# EAGLE design Motherboard (EAGLE 9.6.2)
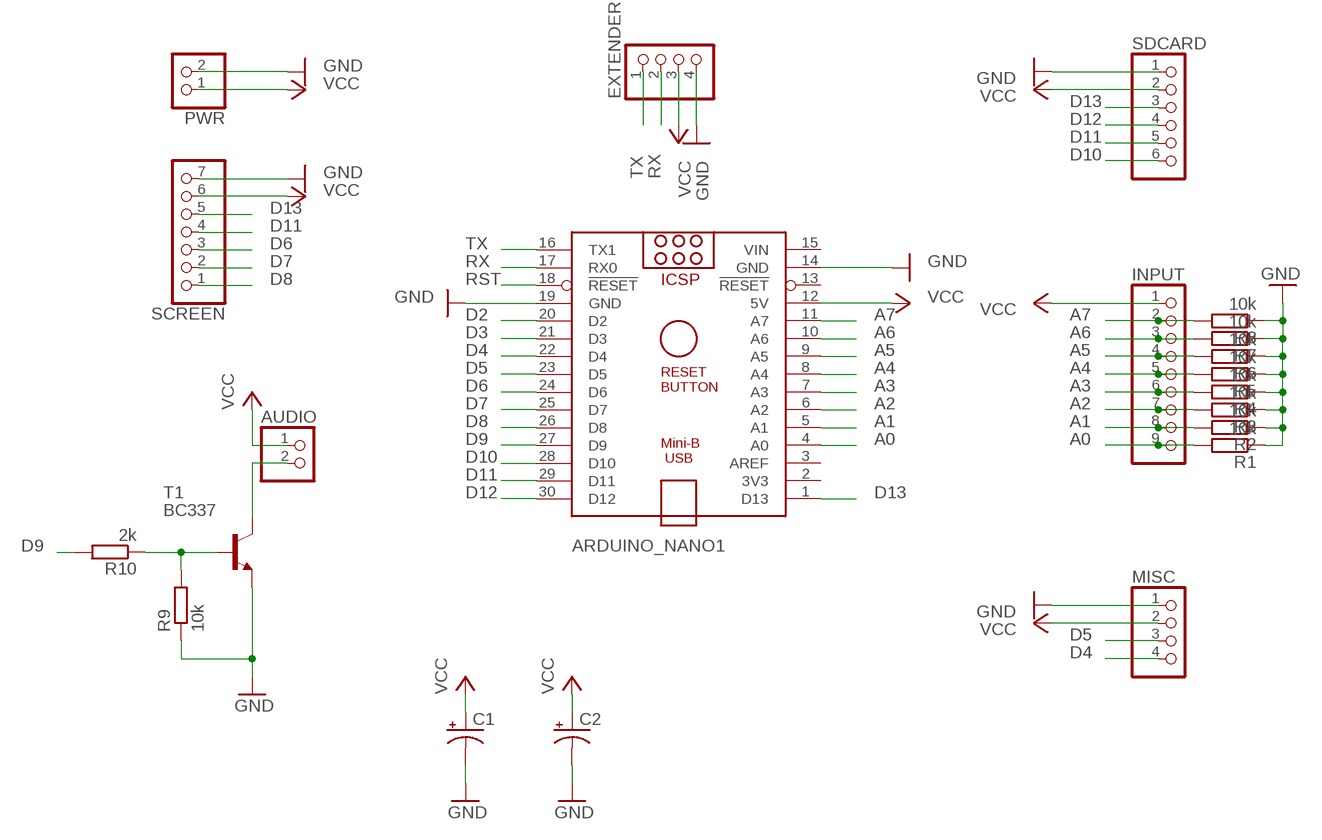
[diagram p0: schematic, sheet 1]

## Parts
ARDUINO_NANO1  ARDUINO_NANO  [ARDUINO_NANO]
AUDIO  PINHD-1X2  [1X02]
C1  CPOL-USE2.5-6  [E2,5-6]
C2  CPOL-USE2.5-6  [E2,5-6]
EXTENDER  PINHD-1X4  [1X04]
INPUT  PINHD-1X9  [1X09]
MISC  PINHD-1X4  [1X04]
PWR  PINHD-1X2  [1X02]
R1  10k  R-EU_0204/7  [0204/7]
R2  10k  R-EU_0204/7  [0204/7]
R3  10k  R-EU_0204/7  [0204/7]
R4  10k  R-EU_0204/7  [0204/7]
R5  10k  R-EU_0204/7  [0204/7]
R6  10k  R-EU_0204/7  [0204/7]
R7  10k  R-EU_0204/7  [0204/7]
R8  10k  R-EU_0204/7  [0204/7]
R9  10k  R-EU_0204/7  [0204/7]
R10  2k  R-EU_0204/7  [0204/7]
SCREEN  PINHD-1X7  [1X07]
SDCARD  PINHD-1X6  [1X06]
T1  BC337  [TO92]

## Nets
A0: ARDUINO_NANO1.4(A0) INPUT.9 R1.2
A1: ARDUINO_NANO1.5(A1) INPUT.8 R2.2
A2: ARDUINO_NANO1.6(A2) INPUT.7 R3.2
A3: ARDUINO_NANO1.7(A3) INPUT.6 R4.2
A4: ARDUINO_NANO1.8(A4) INPUT.5 R5.2
A5: ARDUINO_NANO1.9(A5) INPUT.4 R6.2
A6: ARDUINO_NANO1.10(A6) INPUT.3 R7.2
A7: ARDUINO_NANO1.11(A7) INPUT.2 R8.2
D2: ARDUINO_NANO1.20(D2)
D3: ARDUINO_NANO1.21(D3)
D4: ARDUINO_NANO1.22(D4) MISC.4
D5: ARDUINO_NANO1.23(D5) MISC.3
D6: ARDUINO_NANO1.24(D6) SCREEN.3
D7: ARDUINO_NANO1.25(D7) SCREEN.2
D8: ARDUINO_NANO1.26(D8) SCREEN.1
D9: ARDUINO_NANO1.27(D9) R10.2
D10: ARDUINO_NANO1.28(D10) SDCARD.6
D11: ARDUINO_NANO1.29(D11) SCREEN.4 SDCARD.5
D12: ARDUINO_NANO1.30(D12) SDCARD.4
D13: ARDUINO_NANO1.1(D13) SCREEN.5 SDCARD.3
GND: ARDUINO_NANO1.14(GND) ARDUINO_NANO1.19(GND) C1.- C2.- EXTENDER.4 MISC.1 PWR.2 R1.1 R2.1 R3.1 R4.1 R5.1 R6.1 R7.1 R8.1 R9.1 SCREEN.7 SDCARD.1 T1.1(E)
N$12: AUDIO.2 T1.3(C)
N$13: R9.2 R10.1 T1.2(B)
RST: ARDUINO_NANO1.18(!RESET)
RX: ARDUINO_NANO1.17(RX0) EXTENDER.2
TX: ARDUINO_NANO1.16(TX1) EXTENDER.1
VCC: ARDUINO_NANO1.12(5V) AUDIO.1 C1.+ C2.+ EXTENDER.3 INPUT.1 MISC.2 PWR.1 SCREEN.6 SDCARD.2
Unconnected: ARDUINO_NANO1.2(3V3) ARDUINO_NANO1.3(AREF) ARDUINO_NANO1.13(!RESET)

## Power pins joined to a net without a drawn wire
VIN: ARDUINO_NANO1.15(VIN)

## Library data of the parts
ARDUINO_NANO1 = ArduinoNanoV30:ARDUINO_NANO: Arduino Nano V3.0 Overview: The Arduino Nano is a small, complete, and breadboard-friendly board based on the ATmega328 (Arduino Nano 3.x) or ATmega168 (Arduino Nano 2.x). It has more or less the same functionality of the Arduino Duemilanove, but in a different package. It lacks only a DC power jack, and works with a Mini-B USB cable instead of a standard one. The Nano was designed and is being produced by Gravitech. Specifications: Microcontroller Atmel ATmega168 or ATmega328 Operating Voltage (logic level) 5 V Input Voltage (recommended) 7-12 V Input Voltage (limits) 6-20 V Digital I/O Pins 14 (of which 6 provide PWM output) Analog Input Pins 8 DC Current per I/O Pin 40 mA Flash Memory 16 KB (ATmega168) or 32 KB (ATmega328) of which 2 KB used by bootloader SRAM 1 KB (ATmega168) or 2 KB (ATmega328) EEPROM 512 bytes (ATmega168) or 1 KB (ATmega328) Clock Speed 16 MHz Dimensions 0.73" x 1.70" Length 45 mm Width 18 mm Weigth 5 g Power: The Arduino Nano can be powered via the Mini-B USB connection, 6-20V unregulated external power supply (pin 30), or 5V regulated external power supply (pin 27). The power source is automatically selected to the highest voltage source. Memory: The ATmega168 has 16 KB of flash memory for storing code (of which 2 KB is used for the bootloader); the ATmega328 has 32 KB, (also with 2 KB used for the bootloader). The ATmega168 has 1 KB of SRAM and 512 bytes of EEPROM (which can be read and written with the EEPROM library); the ATmega328 has 2 KB of SRAM and 1 KB of EEPROM. Input and Output: Each of the 14 digital pins on the Nano can be used as an input or output, using pinMode(), digitalWrite(), and digitalRead() functions. They operate at 5 volts. Each pin can provide or receive a maximum of 40 mA and has an internal pull-up resistor (disconnected by default) of 20-50 kOhms. In addition, some pins have specialized functions. Visit Arduino - ArduinoBoardNano <https://www.arduino.cc/en/Main/ArduinoBoardNano>
AUDIO PWR = pinhead:PINHD-1X2: PIN HEADER
C1 C2 = rcl:CPOL-US: POLARIZED CAPACITOR, American symbol; SPICEPREFIX: C
EXTENDER MISC = pinhead:PINHD-1X4: PIN HEADER
INPUT = pinhead:PINHD-1X9: PIN HEADER
R1-R10 = rcl:R-EU_: RESISTOR, European symbol; SPICEPREFIX: R
SCREEN = pinhead:PINHD-1X7: PIN HEADER
SDCARD = pinhead:PINHD-1X6: PIN HEADER
T1 = transistor:BC337: NPN TRANSISTOR

## Board
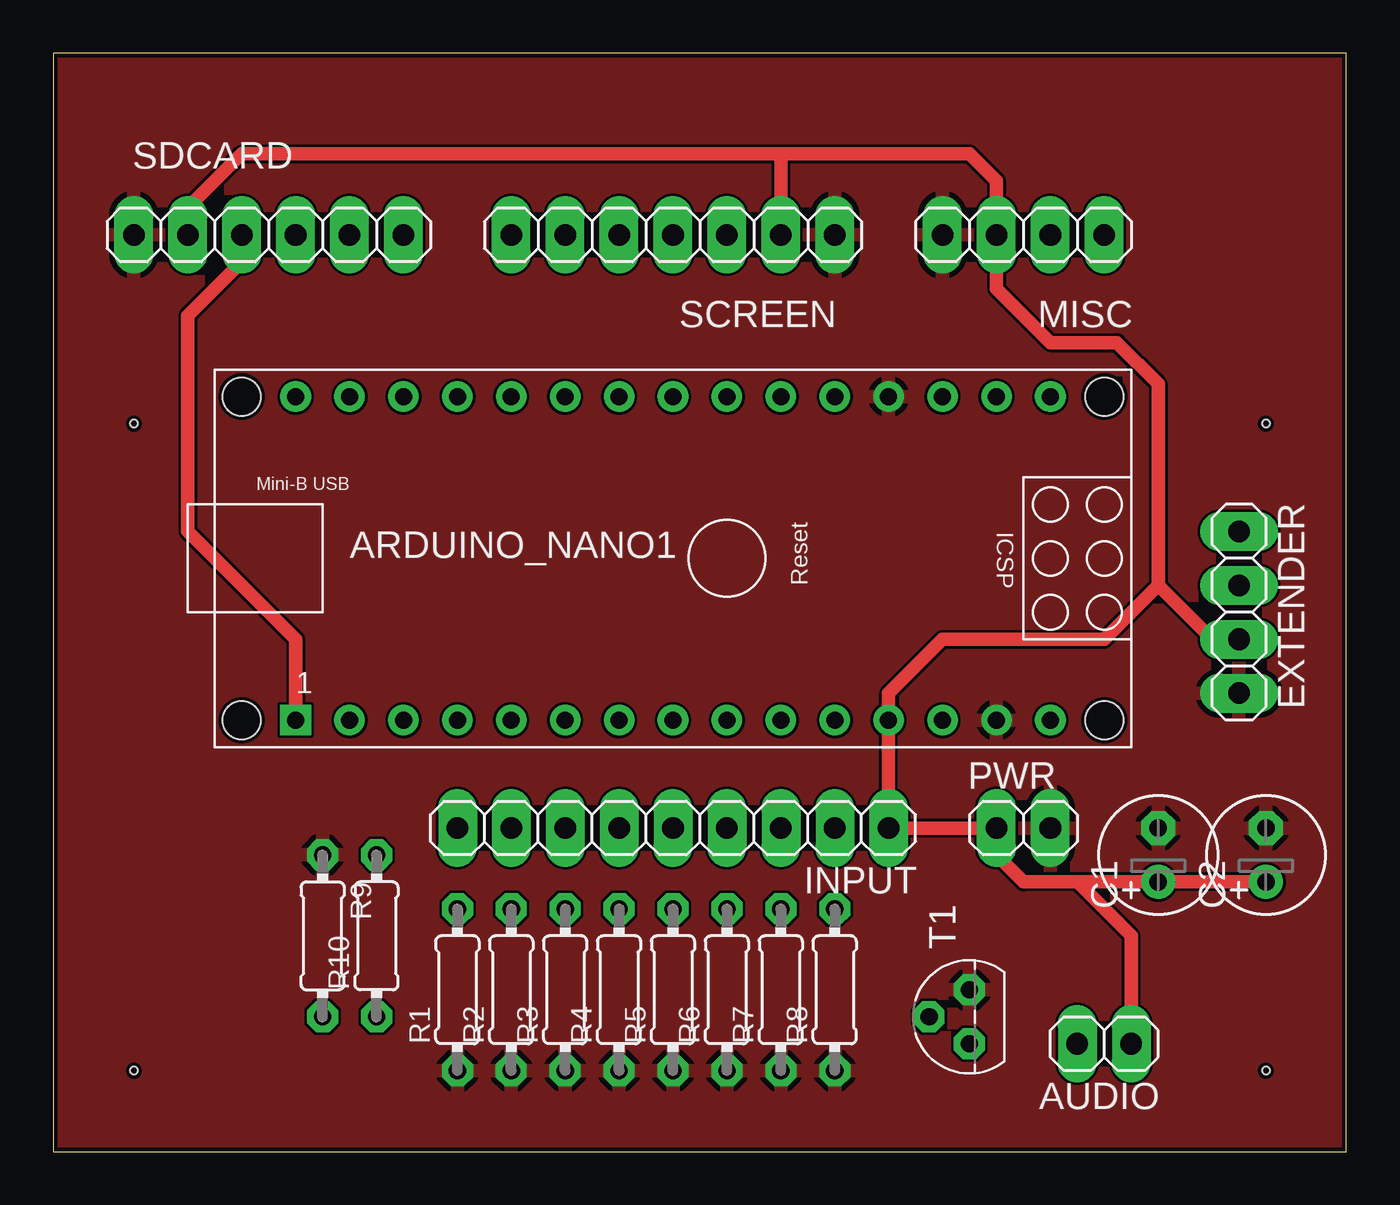
[diagram p1: board, top side]
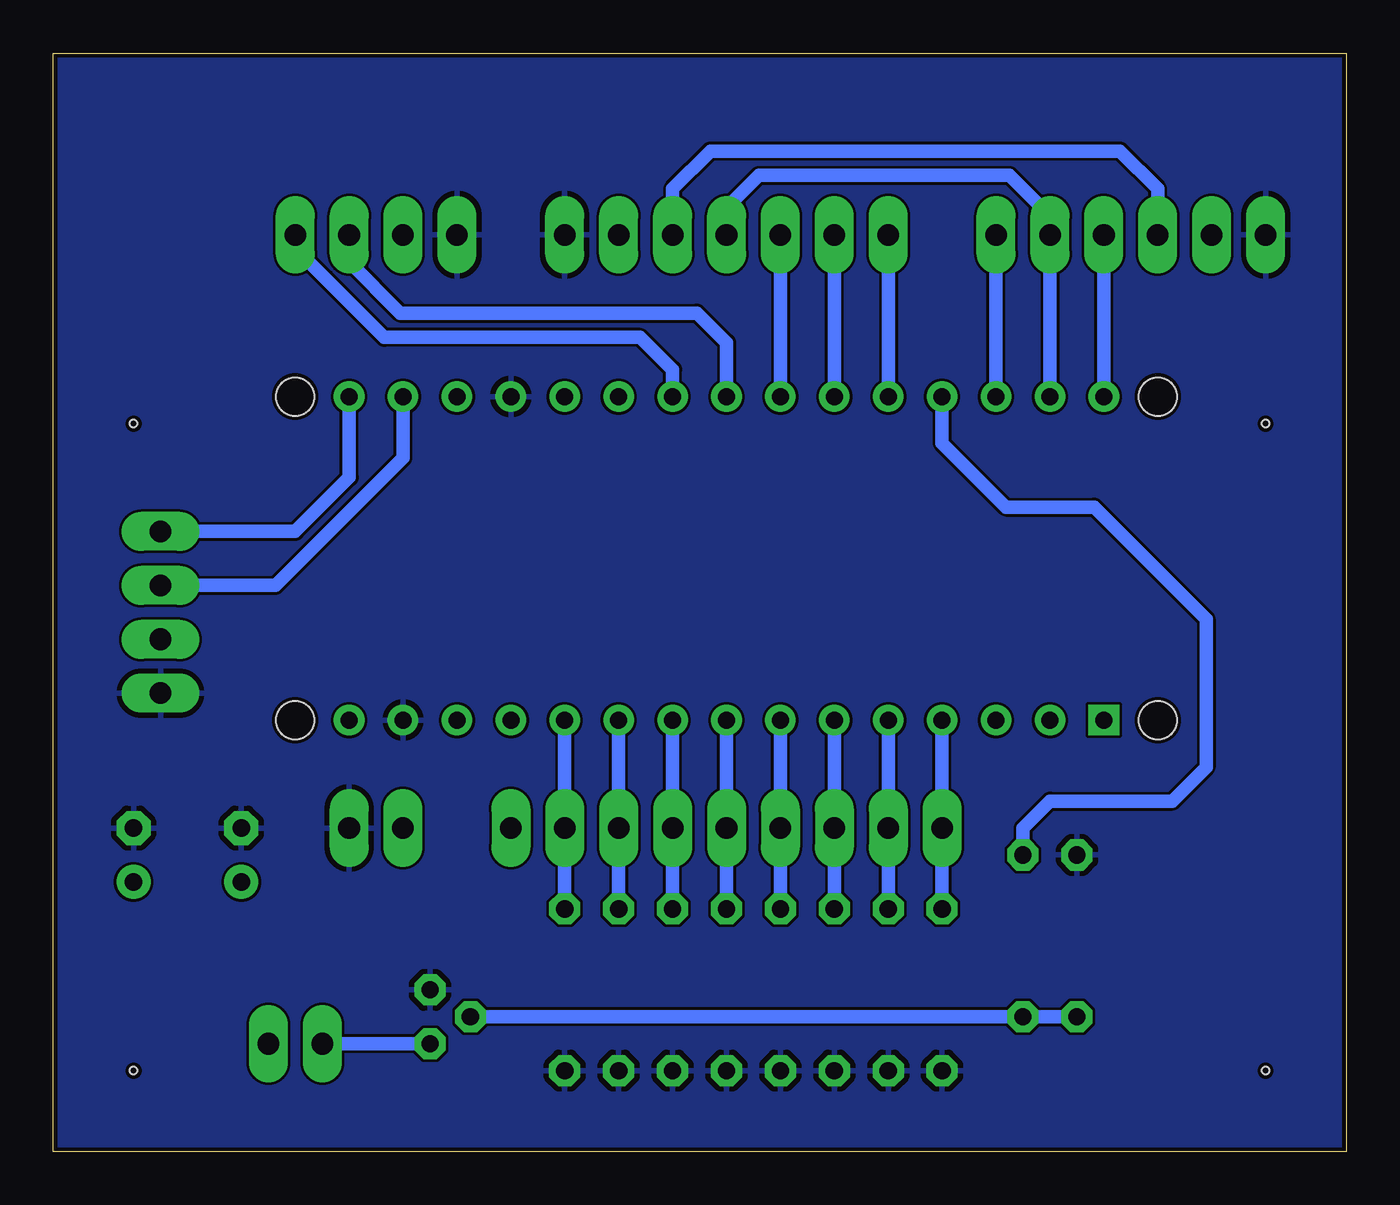
[diagram p2: board, bottom side, seen from below]

Size 60.94 x 51.74 mm. Coordinates in mm from the lower left corner, seen from the top.
Outline: 0,0 60.94,0 60.94,51.74 0,51.74 0,0
Copper layers (1*16): Top 0.035mm / dielectric 1.6mm / Bottom 0.035mm
Design rules "jlcpcb-2layers": minimum track width 5mil, minimum drill 0.3mm, track to track 5mil, track to pad 5mil, pad to pad 5mil, via to via 5mil, smd to smd 5mil, copper to edge 0.2mm, drill to drill 6mil, minimum pad ring 10mil, minimum via ring 3mil, stop-mask expansion 4mil, vias tented up to drill 0mil, thermal gap 10mil
Holes 0.35 mm at 57.15,3.81 3.81,3.81 3.81,34.29 57.15,34.29

### Footprints (pad centres in the part's own frame; a part is rotated, then mirrored left to right if it is on the bottom)
ARDUINO_NANO = drill 0.8 square: 1 -20.32,-7.62 | drill 0.8: 2 -17.78,-7.62; 3 -15.24,-7.62; 4 -12.7,-7.62; 5 -10.16,-7.62; 6 -7.62,-7.62; 7 -5.08,-7.62; 8 -2.54,-7.62; 9 0,-7.62; 10 2.54,-7.62; 11 5.08,-7.62; 12 7.62,-7.62; 13 10.16,-7.62; 14 12.7,-7.62; 15 15.24,-7.62; 16 15.24,7.62; 17 12.7,7.62; 18 10.16,7.62; 19 7.62,7.62; 20 5.08,7.62; 21 2.54,7.62; 22 0,7.62; 23 -2.54,7.62; 24 -5.08,7.62; 25 -7.62,7.62; 26 -10.16,7.62; 27 -12.7,7.62; 28 -15.24,7.62; 29 -17.78,7.62; 30 -20.32,7.62 | hole 1.778: -22.86,-7.62; -22.86,7.62; 17.78,7.62; 17.78,-7.62
1X02 = drill 1.016 long: 1 -1.27,0; 2 1.27,0
E2,5-6 = drill 0.813 pad 1.6: + -1.27,0 | drill 0.813 pad 1.6 octagon: - 1.27,0
1X04 = drill 1.016 long: 1 -3.81,0; 2 -1.27,0; 3 1.27,0; 4 3.81,0
1X09 = drill 1.016 long: 1 -10.16,0; 2 -7.62,0; 3 -5.08,0; 4 -2.54,0; 5 0,0; 6 2.54,0; 7 5.08,0; 8 7.62,0; 9 10.16,0
0204/7 = drill 0.813 octagon: 1 -3.81,0; 2 3.81,0
1X07 = drill 1.016 long: 1 -7.62,0; 2 -5.08,0; 3 -2.54,0; 4 0,0; 5 2.54,0; 6 5.08,0; 7 7.62,0
1X06 = drill 1.016 long: 1 -6.35,0; 2 -3.81,0; 3 -1.27,0; 4 1.27,0; 5 3.81,0; 6 6.35,0
TO92 = drill 0.813 octagon: 1 1.27,0; 2 0,1.905; 3 -1.27,0

### Placement (x,y rotation side)
ARDUINO_NANO1  31.75,27.94 0 top
AUDIO  49.53,5.08 180 top
C1  52.07,13.97 90 top
C2  57.15,13.97 90 top
EXTENDER  55.88,25.4 270 top
INPUT  29.21,15.24 180 top
MISC  45.72,43.18 0 top
PWR  45.72,15.24 0 top
R1  19.05,7.62 90 top
R2  21.59,7.62 90 top
R3  24.13,7.62 90 top
R4  26.67,7.62 90 top
R5  29.21,7.62 90 top
R6  31.75,7.62 90 top
R7  34.29,7.62 90 top
R8  36.83,7.62 90 top
R9  12.7,10.16 270 top
R10  15.24,10.16 90 top
SCREEN  29.21,43.18 0 top
SDCARD  10.16,43.18 0 top
T1  43.18,6.35 90 top

### Tracks (layer width: path | path; a pad name or v marks a point on that pad's centre or on a via)
A0
  Bottom 0.635: R1.2 INPUT.9 ARDUINO_NANO1.4
A1
  Bottom 0.635: R2.2 INPUT.8 ARDUINO_NANO1.5
A2
  Bottom 0.635: R3.2 INPUT.7 ARDUINO_NANO1.6
A3
  Bottom 0.635: R4.2 INPUT.6 ARDUINO_NANO1.7
A4
  Bottom 0.635: R5.2 INPUT.5 ARDUINO_NANO1.8
A5
  Bottom 0.635: R6.2 INPUT.4 ARDUINO_NANO1.9
A6
  Bottom 0.635: ARDUINO_NANO1.10 INPUT.3 R7.2
A7
  Bottom 0.635: ARDUINO_NANO1.11 INPUT.2 R8.2
D4
  Bottom 0.635: ARDUINO_NANO1.22 31.75,36.83 33.27,38.35 45.34,38.35 49.53,42.55 MISC.4
D5
  Bottom 0.635: MISC.3 46.99,41.91 44.58,39.5 30.61,39.5 29.21,38.1 ARDUINO_NANO1.23
D6
  Bottom 0.635: SCREEN.3 ARDUINO_NANO1.24
D7
  Bottom 0.635: ARDUINO_NANO1.25 SCREEN.2
D8
  Bottom 0.635: SCREEN.1 ARDUINO_NANO1.26
D9
  Bottom 0.635: ARDUINO_NANO1.27 19.05,33.37 16.04,30.35 11.88,30.35 6.6,25.08 6.6,18.1 8.2,16.51 13.97,16.51 15.24,15.24 R10.2
D10
  Bottom 0.635: ARDUINO_NANO1.28 SDCARD.6
D11
  Bottom 0.635: ARDUINO_NANO1.29 SDCARD.5 13.97,44.07 15.88,45.97 27.69,45.97 29.21,44.45 SCREEN.4
D12
  Bottom 0.635: ARDUINO_NANO1.30 SDCARD.4
D13
  Top 0.635: SDCARD.3 8.89,41.91 6.35,39.37 6.35,29.21 11.43,24.13 ARDUINO_NANO1.1
  Bottom 0.635: SDCARD.3 8.89,45.34 10.67,47.12 29.97,47.12 31.75,45.34 SCREEN.5
GND
  pour Bottom: -1.27,80.01 76.2,80.01 76.2,-1.27 -1.27,-1.27
  pour Top: 0,52.07 60.96,52.07 62.23,53.34 62.23,0 0,0
N$12
  Bottom 0.635: T1.3 AUDIO.2
N$13
  Bottom 0.635: R9.2 R10.1 T1.2
RX
  Bottom 0.635: EXTENDER.2 50.45,26.67 44.45,32.67 ARDUINO_NANO1.17
TX
  Bottom 0.635: EXTENDER.1 49.53,29.21 46.99,31.75 ARDUINO_NANO1.16
VCC
  Top 0.635: SDCARD.2 6.35,44.45 8.89,46.99 34.29,46.99 | 34.29,46.99 43.18,46.99 44.45,45.72 MISC.2 44.45,40.64 46.99,38.1 50.13,38.1 52.07,36.16 52.07,26.67 | SCREEN.6 34.29,46.99 | 52.07,26.67 54.61,24.13 EXTENDER.3 | 52.07,26.67 49.53,24.13 41.91,24.13 39.37,21.59 ARDUINO_NANO1.12 INPUT.1 PWR.1 44.45,13.97 45.72,12.7 48.26,12.7 | C2.+ C1.+ 48.26,12.7 | AUDIO.1 50.8,10.16 48.26,12.7